# EAGLE design esp-12-garage-door (EAGLE 9.5.2)
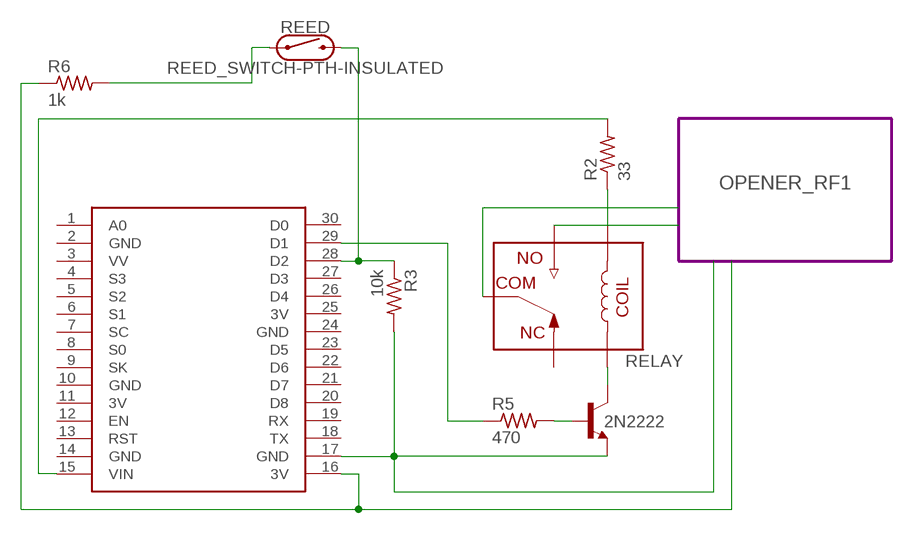
[diagram p0: schematic, sheet 1]

## Parts
2N2222  2N2222-NPN-TO92-EBC  [TO92-EBC]
NODEMCU  NODEMCU  [NODEMCU]
R2  33  R-US_0207/7  [0207/7]
R3  10k  R-US_0207/7  [0207/7]
R5  470  R-US_0207/7  [0207/7]
R6  1k  R-US_0207/7  [0207/7]
REED  REED_SWITCH-PTH-INSULATED  [REED_SWITCH_PLASTIC]
RELAY  JSM1-12V-5  [JSM1-12V-5]

## Module instances
OPENER_RF1 = OPENER_RF

## Nets
GND: 2N2222.E NODEMCU.17(GND) R3.2
N$1: NODEMCU.15(VIN) R2.2
N$2: 2N2222.C RELAY.5
N$3: NODEMCU.28(D2) R3.1 REED.P$2
N$4: RELAY.1
N$5: R2.1 RELAY.2
N$6: 2N2222.B R5.2
N$8: NODEMCU.16(3V) R6.1
N$9: NODEMCU.29(D1) R5.1
N$11: R6.2 REED.P$1
N$12: RELAY.3
Unconnected: NODEMCU.1(A0) NODEMCU.3(VV) NODEMCU.4(S3) NODEMCU.5(S2) NODEMCU.6(S1) NODEMCU.7(SC) NODEMCU.8(S0) NODEMCU.9(SK) NODEMCU.12(EN) NODEMCU.13(RST) NODEMCU.18(TX) NODEMCU.19(RX) NODEMCU.20(D8) NODEMCU.21(D7) NODEMCU.22(D6) NODEMCU.23(D5) NODEMCU.26(D4) NODEMCU.27(D3) NODEMCU.30(D0) RELAY.4

## Power pins joined to a net without a drawn wire
3V: NODEMCU.11(3V) NODEMCU.25(3V)
GND: NODEMCU.2(GND) NODEMCU.10(GND) NODEMCU.14(GND) NODEMCU.24(GND)

## Library data of the parts
2N2222 = transistor-neu-to92:*-NPN-: NPN Transistror
NODEMCU = nodemcu:NODEMCU
R2 R3 R5 R6 = adafruit:R-US_: RESISTOR, American symbol
REED = SparkFun-Switches:REED_SWITCH: Reed Switch A reed switch is a magnetically-actuated switch. When the device is exposed to a magnetic field, the two ferrous materials inside the switch pull together and the switch closes. Variant Overview PTH-GLASS Reed Switch <https://www.sparkfun.com/products/8642> (COM-08642) - PTH reed switch w/ glass body (6.0 x 0.9 mm) PTH-INSULATED Reed Switch - Insulated <https://www.sparkfun.com/products/10601> (COM-10601) - PTH reed switch w/ insulated body (15.1 x 4.2 mm); PROD_ID: SWCH-10467; SF_SKU: COM-10601
RELAY = Relay:JSM1-12V-5: RELAY AUTOMOTIVE SPDT 15A 12V Manufacturer's datasheet <https://media.digikey.com/pdf/Data%20Sheets/Panasonic%20Electric%20Works%20PDFs/JS-M_Series_Rev_Dec_2011.pdf>; CREATED_BY: PCBLayout.com; DIGIKEY_PARTNO: 255-1240-ND; MANUFACTURER: Panasonic Electric Works; MPN: JSM1-12V-5

## Module OPENER_RF
Ports: 

### Library data of the parts

## Board
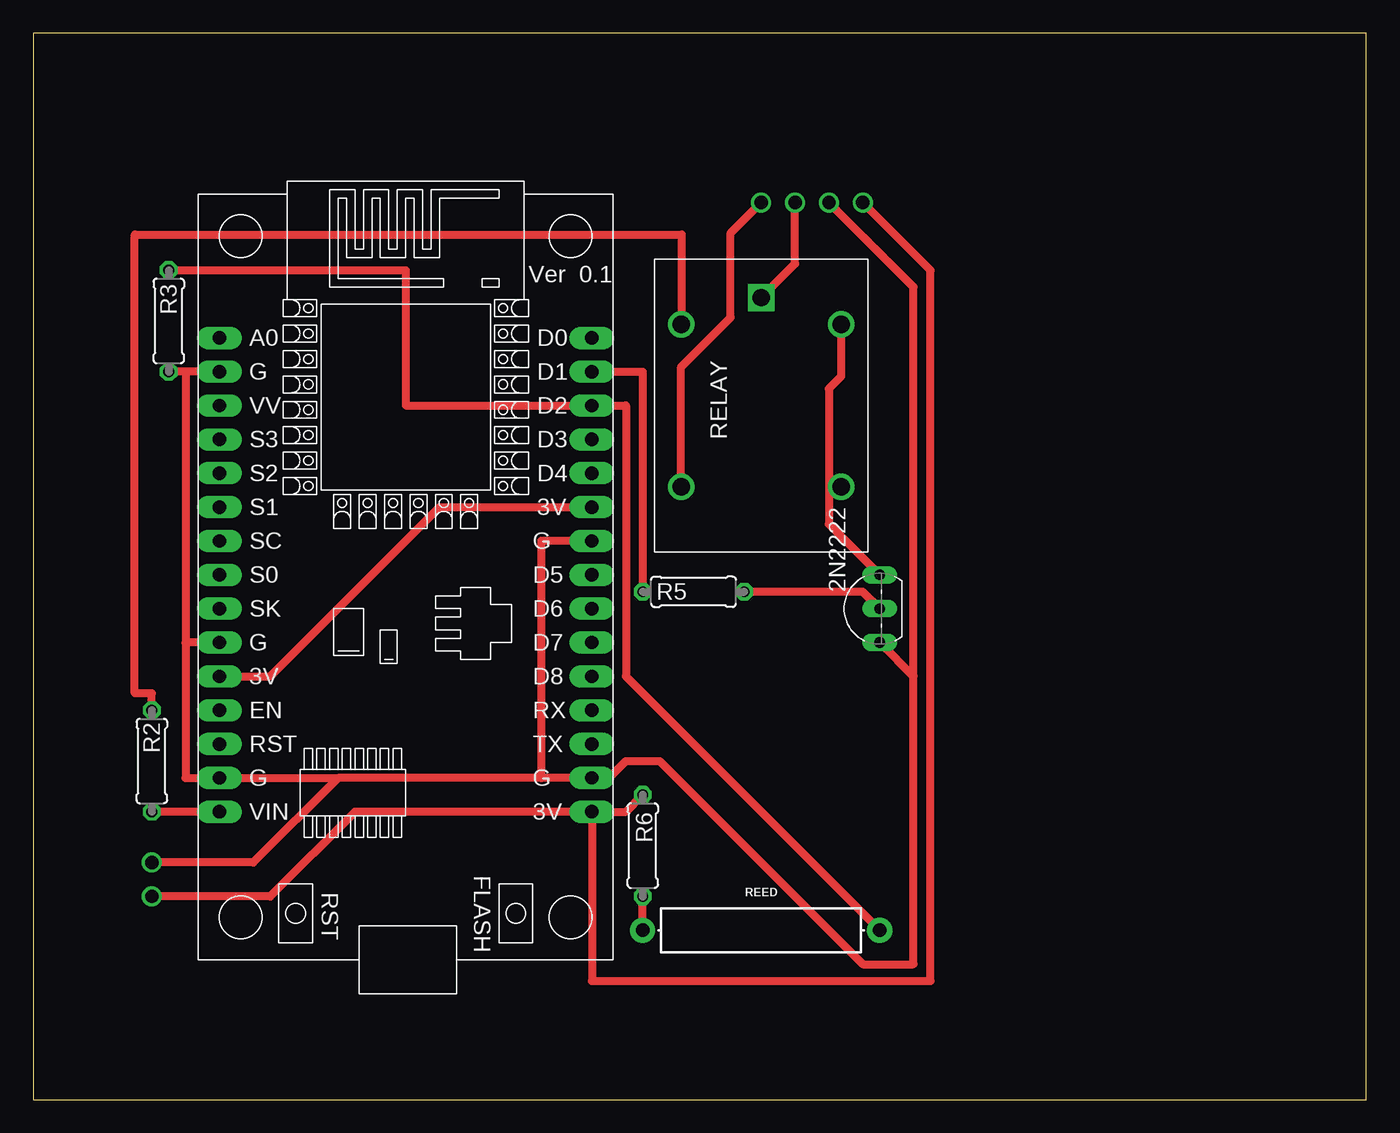
[diagram p1: board, top side]

Size 100 x 80 mm. Coordinates in mm from the lower left corner, seen from the top.
Outline: 0,0 100,0 100,80 0,80 0,0
Copper layers (1*16): Top 0.035mm / dielectric 1.5mm / Bottom 0.035mm
Design rules "default": minimum track width 6mil, minimum drill 0.35mm, track to track 6mil, track to pad 6mil, pad to pad 6mil, via to via 6mil, smd to smd 6mil, copper to edge 40mil, drill to drill 6mil, minimum pad ring 10mil, minimum via ring 8mil, stop-mask expansion 4mil, vias tented up to drill 0mil, thermal gap 10mil

### Footprints (pad centres in the part's own frame; a part is rotated, then mirrored left to right if it is on the bottom)
TO92-EBC = drill 0.813 long: B 0,-1.27; C 2.54,-1.27; E -2.54,-1.27
NODEMCU = drill 1 pad 1.676 long: 1 -13.97,17.78; 2 -13.97,15.24; 3 -13.97,12.7; 4 -13.97,10.16; 5 -13.97,7.62; 6 -13.97,5.08; 7 -13.97,2.54; 8 -13.97,0; 9 -13.97,-2.54; 10 -13.97,-5.08; 11 -13.97,-7.62; 12 -13.97,-10.16; 13 -13.97,-12.7; 14 -13.97,-15.24; 15 -13.97,-17.78; 16 13.97,-17.78; 17 13.97,-15.24; 18 13.97,-12.7; 19 13.97,-10.16; 20 13.97,-7.62; 21 13.97,-5.08; 22 13.97,-2.54; 23 13.97,0; 24 13.97,2.54; 25 13.97,5.08; 26 13.97,7.62; 27 13.97,10.16; 28 13.97,12.7; 29 13.97,15.24; 30 13.97,17.78
0207/7 = drill 0.813 octagon: 1 -3.81,0; 2 3.81,0
REED_SWITCH_PLASTIC = drill 1.016 pad 1.88: P$1 -8.89,0; P$2 8.89,0
JSM1-12V-5 = drill 1.3 pad 2 square: 1 8.1,0 | drill 1.3 pad 2: 2 6.1,6; 3 -6.1,6; 4 -6.1,-6; 5 6.1,-6

### Placement (x,y rotation side)
2N2222  62.23,36.83 90 top
NODEMCU  27.94,39.37 0 top
R2  8.89,25.4 270 top
R3  10.16,58.42 270 top
R5  49.53,38.1 0 top
R6  45.72,19.05 270 top
REED  54.61,12.7 0 top
RELAY  54.61,52.07 90 top

### Tracks (layer width: path | path; a pad name or v marks a point on that pad's centre or on a via)
3V
  Top 0.61: NODEMCU.11 17.78,31.75 30.48,44.45 NODEMCU.25
GND  (via drill 1)
  Top 0.61: 2N2222.E 66.04,31.75 | 66.04,31.75 66.04,10.16 62.23,10.16 46.99,25.4 44.45,25.4 43.18,24.13 NODEMCU.17 38.1,24.13 | 22.86,24.13 16.51,17.78 v8.89,17.78 | 66.04,31.75 66.04,60.96 v59.69,67.31 | 22.86,24.13 NODEMCU.14 11.43,24.13 11.43,34.29 | 38.1,24.13 22.86,24.13 | NODEMCU.24 38.1,41.91 38.1,24.13 | NODEMCU.2 11.43,54.61 | 11.43,54.61 R3.2 | 11.43,54.61 11.43,34.29 | NODEMCU.10 11.43,34.29
N$1
  Top 0.61: NODEMCU.15 R2.2
N$2
  Top 0.61: RELAY.5 60.61,54.26 59.69,53.34 59.69,43.18 2N2222.C
N$3
  Top 0.61: R3.1 27.94,62.23 27.94,52.07 NODEMCU.28 44.45,52.07 44.45,31.75 REED.P$2
N$4  (via drill 1)
  Top 0.61: RELAY.1 57.15,62.71 v57.15,67.31
N$5
  Top 0.61: R2.1 8.89,30.48 7.62,30.48 7.62,64.9 48.64,64.9 48.64,58.2 RELAY.2
N$6
  Top 0.61: 2N2222.B 62.23,38.1 R5.2
N$8  (via drill 1)
  Top 0.61: NODEMCU.16 24.13,21.59 17.78,15.24 v8.89,15.24 | NODEMCU.16 41.91,8.89 67.31,8.89 67.31,62.23 v62.23,67.31 | NODEMCU.16 44.45,21.59 R6.1
N$9
  Top 0.61: NODEMCU.29 45.72,54.61 R5.1
N$11
  Top 0.61: REED.P$1 R6.2
N$12  (via drill 1)
  Top 0.61: RELAY.3 48.61,54.96 52.32,58.67 52.32,65.02 v54.61,67.31